# EasyEDA Pro project 包裹款-触摸屏控制板V1.3.eprj, schematic 原理图
Board Name: ESP32s3; Create Date: 2025-05-14; Page Name: 电源; Project Name: 包裹款-触摸屏控制板V1.3; Schematic Name: 原理图; Update Date: 2026-04-14; Company: 嘉立创EDA; Page Size: A3; Version: V1.0
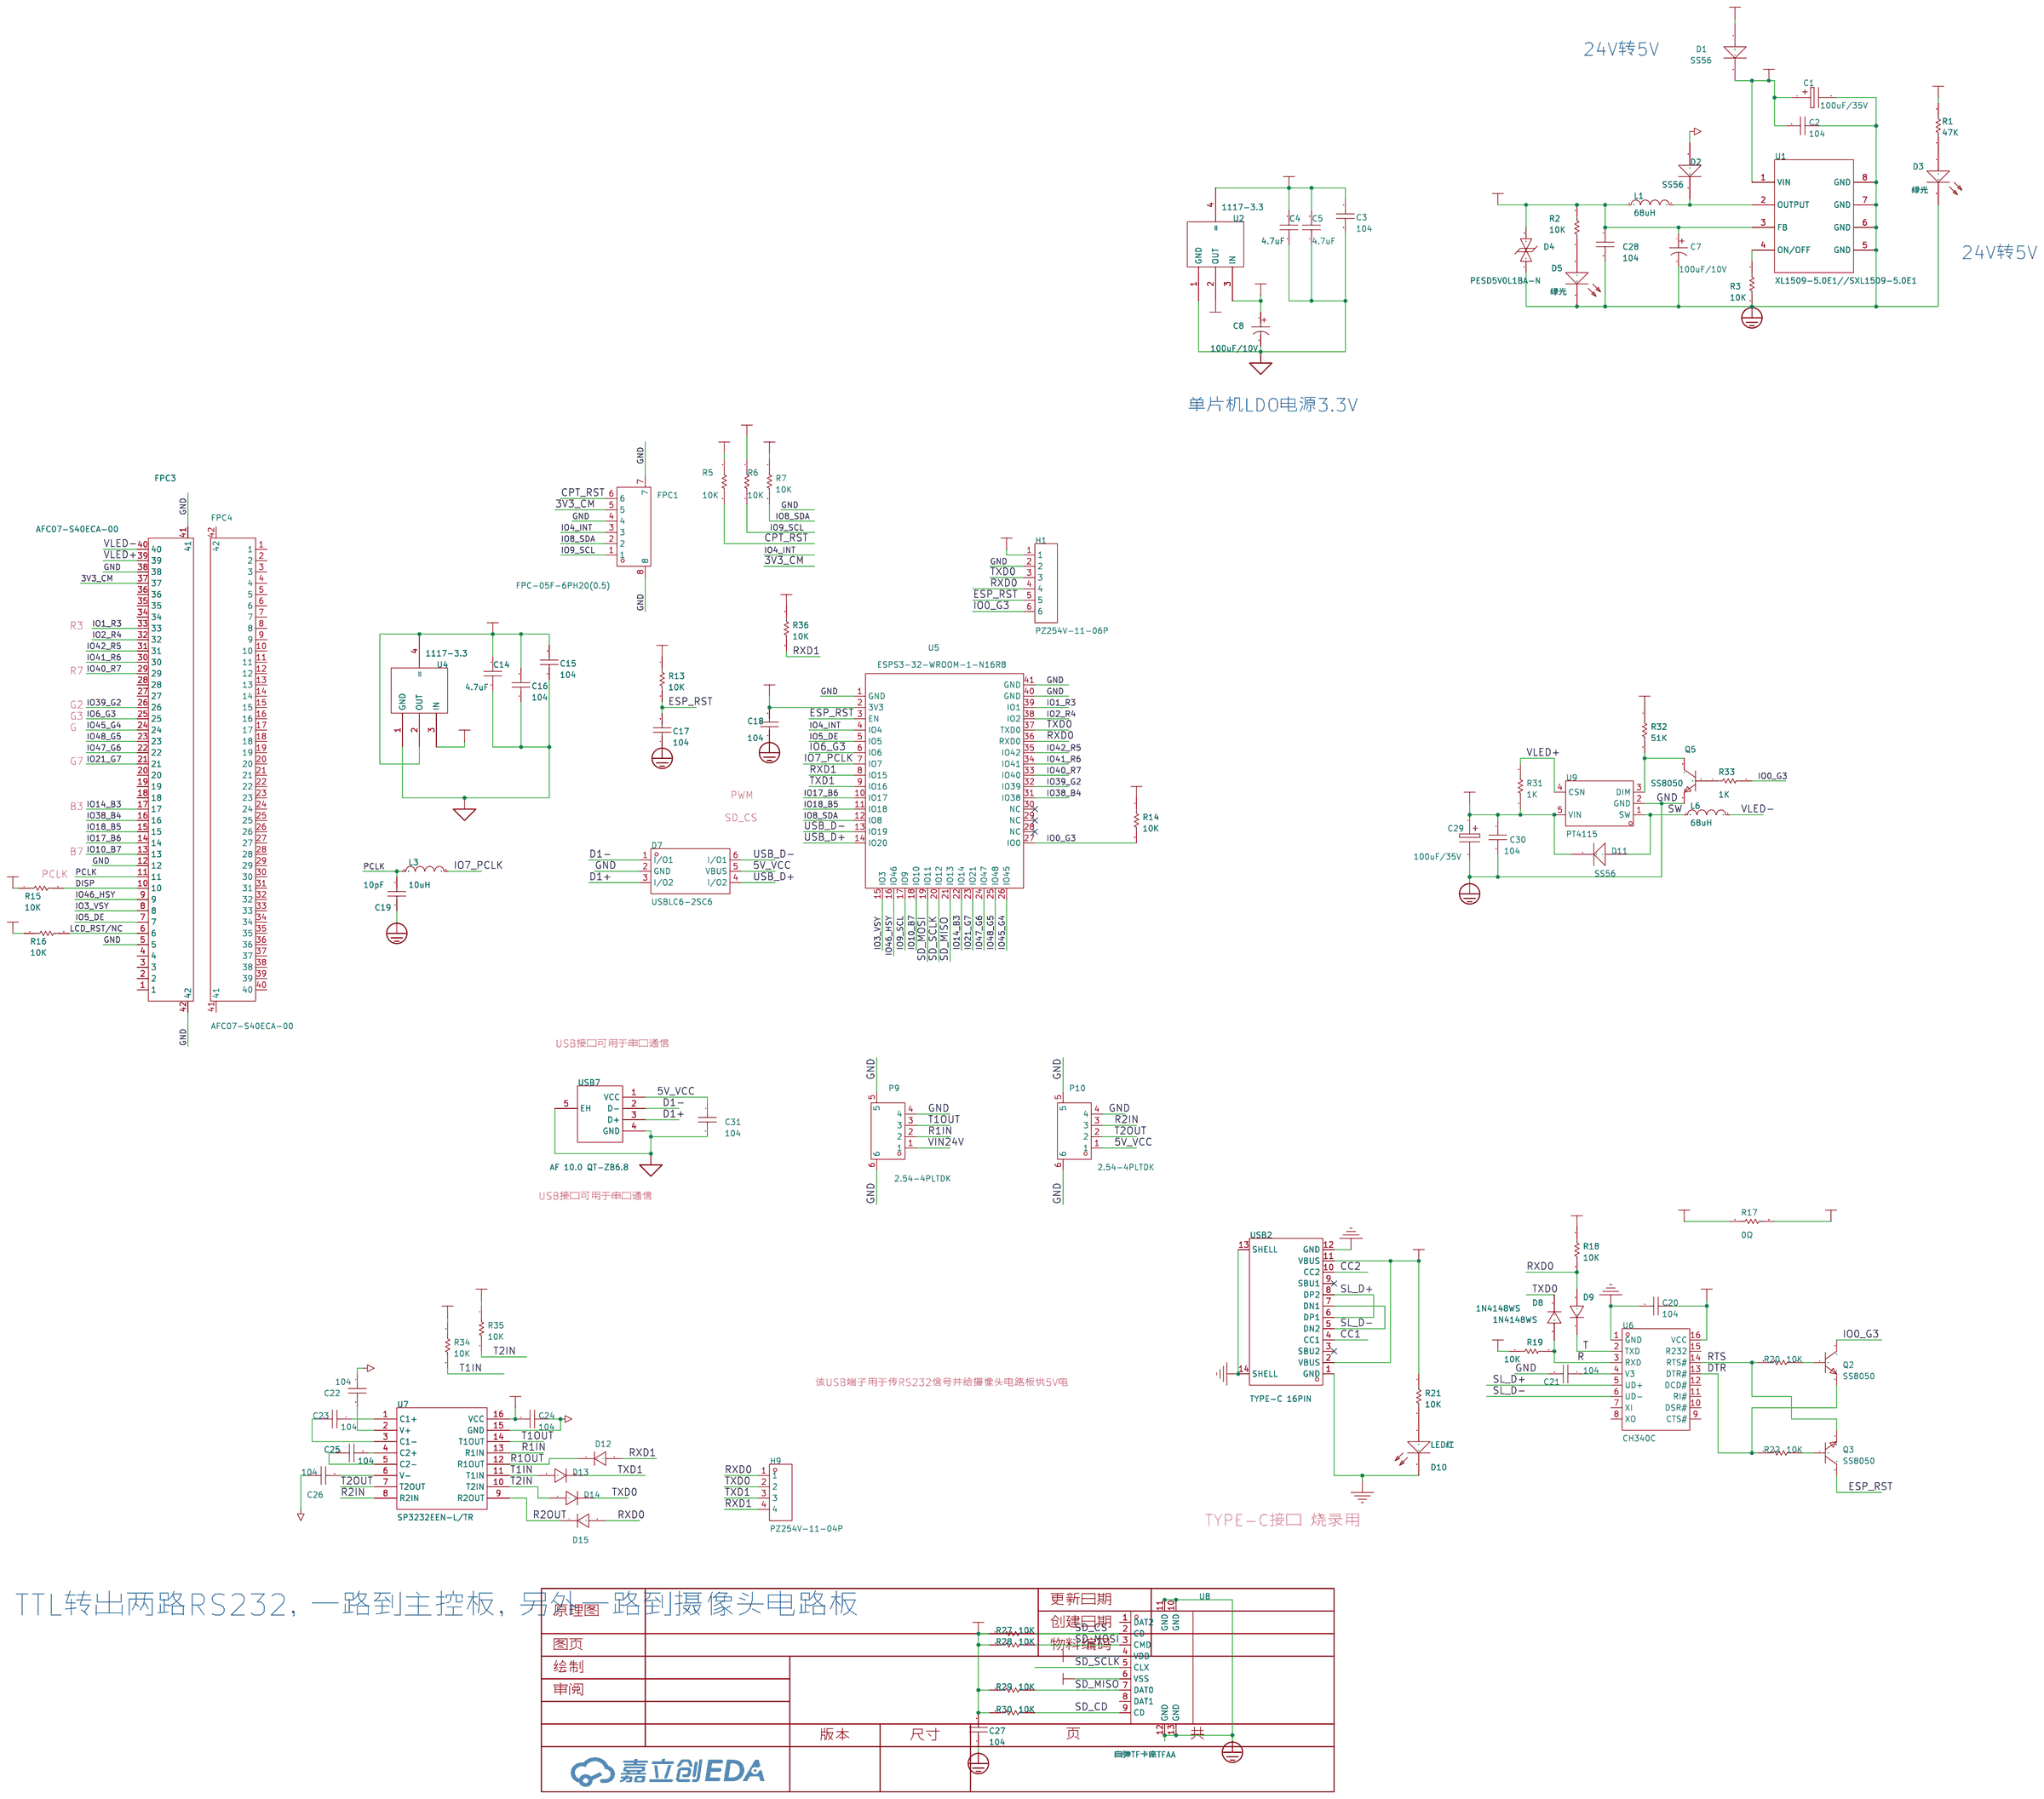
[diagram p0: schematic sheet]

## Parts
C1  100uF/35V  [电解电容贴片6X6]
C2  104  [0603C]
C3  104  [0603C]
C4  4.7uF  [C1206]
C5  4.7uF  [C1206]
C7  100uF/10V  [CAP-SMD_BD5.0-L5.3-W5.3-RD]
C8  100uF/10V  [CAP-SMD_BD5.0-L5.3-W5.3-RD]
C14  4.7uF  [C1206]
C15  104  [0603C]
C16  104  [0603C]
C17  104  [0603C]
C18  104  [0603C]
C19  10pF  [0603C]
C20  104  [0603C]
C21  104  [0603C]
C22  104  [0603C]
C23  104  [0603C]
C24  104  [0603C]
C25  104  [0603C]
C26  104  [0603C]
C27  104  [11]
C28  104  [0603C]
C29  100uF/35V  [电解电容贴片6X6]
C30  104  [0603C]
C31  104  [0603C]
D1  SS56  [SMA]
D2  SS56  [SMA]
D3  绿光  [0603LED]
D4  PESD5V0L1BA-N  [SOD-323_L1.8-W1.3-LS2.5-BI]
D5  绿光  [0603LED]
D7  USBLC6-2SC6  [SOT-23-6_L2.9-W1.6-P0.95-LS2.8-BL]
D8  1N4148WS  [SOD-323_L1.8-W1.3-LS2.5-RD]
D9  1N4148WS  [SOD-323_L1.8-W1.3-LS2.5-RD]
D10  LED红  [0603L]
D11  SS56  [SMA]
D12  1N4148WS  [SOD-323_L1.8-W1.3-LS2.5-RD]
D13  1N4148WS  [SOD-323_L1.8-W1.3-LS2.5-RD]
D14  1N4148WS  [SOD-323_L1.8-W1.3-LS2.5-RD]
D15  1N4148WS  [SOD-323_L1.8-W1.3-LS2.5-RD]
FPC1  FPC-05F-6PH20(0.5)  [FPC-SMD_6P-P0.50_XUNPU_FPC-05F-6PH20]
FPC3  AFC07-S40ECA-00  [FPC-SMD_P0.50-40P_LCS-SJ-H2.0]
FPC4  AFC07-S40ECA-00  [FPC-SMD_P0.50-40P_LCS-SJ-H2.0]
H1  PZ254V-11-06P  [HDR-TH_6P-P2.54-V-M]
H9  PZ254V-11-04P  [HDR-TH_4P-P2.54-V-M]
L1  68uH  [IND-SMD_L7.0-W7.0_SMDRI74-330MT]
L3  10uH  [L0603]
L6  68uH  [IND-SMD_L7.0-W7.0_SMDRI74-330MT]
P9  2.54-4PLTDK  [CONN-SMD_4P-P2.50_SHOU_2.54-4PLTDK]
P10  2.54-4PLTDK  [CONN-SMD_4P-P2.50_SHOU_2.54-4PLTDK]
Q2  SS8050  [SOT-23-3_L2.9-W1.3-P1.90-LS2.4-BR]
Q3  SS8050  [SOT-23-3_L2.9-W1.3-P1.90-LS2.4-BR]
Q5  SS8050  [SOT-23-3_L2.9-W1.3-P1.90-LS2.4-BR]
R1  47K  [0603R]
R2  10K  [0603R]
R3  10K  [0603R]
R5  10K  [0603R]
R6  10K  [0603R]
R7  10K  [0603R]
R13  10K  [0603R]
R14  10K  [0603R]
R15  10K  [0603R]
R16  10K  [0603R]
R17  0Ω  [10]
R18  10K  [0603R]
R19  10K  [0603R]
R20  10K  [10]
R21  10K  [10]
R22  10K  [10]
R27  10K  [10]
R28  10K  [10]
R29  10K  [10]
R30  10K  [10]
R31  1K  [10]
R32  51K  [10]
R33  1K  [10]
R34  10K  [10]
R35  10K  [10]
R36  10K  [0603R]
U1  XL1509-5.0E1//SXL1509-5.0E1  [ESOP-8_L4.9-W3.9-P1.27-LS6.0-BL-EP]
U2  1117-3.3  [SOT-223]
U4  1117-3.3  [SOT-223]
U5  ESPS3-32-WROOM-1-N16R8  [WIRELM-SMD_ESP32-S3-WROOM-2-N32R8V]
U6  CH340C  [SOIC-16_L9.9-W3.9-P1.27-LS6.0-BL]
U7  SP3232EEN-L/TR  [SOIC-16_L9.9-W3.9-P1.27-LS6.0-BL]
U8  自弹TF卡座TFAA  [SIM-SMD_C9900015645]
U9  PT4115  [SOT-89-5_L4.5-W2.5-P1.50-LS4.5-BR]
USB2  TYPE-C 16PIN  [USB-C-SMD_TYPE-C-6PIN+]
USB7  AF 10.0 QT-ZB6.8  [USB-A-SMD_AF-10.0-QT-ZB6.8]

## Library data of the parts
C1 C29 = 100uF/35V: Origin Footprint 2: X47U; Origin Footprint 1: 电解电容贴片6x6; Design Item ID: ELECTRO1; Library Name: *
C2 C3 C15-C19 C28 C30 C31 = 104: Capacitor (Semiconductor SIM Model); Published: 8-Jun-2000; LatestRevisionDate: 17-Jul-2002; LatestRevisionNote: Re-released for DXP Platform.; PackageReference: C1206; Publisher: Altium Limited; Origin Footprint 2: C1206; Origin Footprint 3: 0402; Origin Footprint 4: 1310[0504]; Origin Footprint 5: 1608[0603]; Origin Footprint 6: C1210; Origin Footprint 7: C0805; Origin Footprint 8: C1206; Origin Footprint 9: 0805; Origin Footprint 10: 0805L; Design Item ID: Cap Semi; Library Name: Miscellaneous Devices
C4 C5 C14 = 104: Design Item ID: CAP; Library Name: SCH--װ--
C7 C8 = CS1A101M-CRD54: 容值:100uF;精度:±20%;额定电压:10V;电容体直径:5mm;电容体长度:5.4mm;纹波电流:-;等效串联电阻:-;工作寿命:1000hrs@105℃;工作温度:-40℃~+105℃;; LCSC Part Name: 100uF ±20% 10V; Supplier Part: C96182; Manufacturer: ST(先科); Supplier Footprint: SMD,5x5.4mm; JLCPCB Part Class: Extended Part; Datasheet: https://atta.szlcsc.com/upload/public/pdf/source/20170304/1488621207726.pdf; Supplier: LCSC; Tolerance: ±20%; Rated Voltage: 10V; φD: 5mm; L: 5.4mm; Lifetime @ Temp: 1000hrs@105℃; Operating Temperature: -40℃~+105℃
C20 C22-C26 = 103: Capacitor (Semiconductor SIM Model); Published: 8-Jun-2000; LatestRevisionDate: 17-Jul-2002; LatestRevisionNote: Re-released for DXP Platform.; PackageReference: C1206; Publisher: Altium Limited; Origin Footprint 2: C1206; Origin Footprint 3: 0402; Origin Footprint 4: 1310[0504]; Origin Footprint 5: 1608[0603]; Origin Footprint 6: C1210; Origin Footprint 7: C0805; Origin Footprint 8: C1206; Origin Footprint 9: 0805; Origin Footprint 10: 0805L; Design Item ID: Cap Semi; Library Name: Miscellaneous Devices
C21 = 104: Capacitor (Semiconductor SIM Model); Published: 8-Jun-2000; LatestRevisionDate: 17-Jul-2002; LatestRevisionNote: Re-released for DXP Platform.; PackageReference: C1206; Publisher: Altium Limited; Origin Footprint 2: C1206; Origin Footprint 3: 0402; Origin Footprint 4: 1310[0504]; Origin Footprint 5: 1608[0603]; Origin Footprint 6: C1210; Origin Footprint 7: C0805; Origin Footprint 8: C1206; Origin Footprint 9: 0805; Origin Footprint 10: 0805L; Origin Footprint 11: 0805C; Design Item ID: Cap Semi; Library Name: Miscellaneous Devices
C27 = 104: Capacitor (Semiconductor SIM Model); Published: 8-Jun-2000; LatestRevisionDate: 17-Jul-2002; LatestRevisionNote: Re-released for DXP Platform.; PackageReference: C1206; Publisher: Altium Limited; Origin Footprint 2: C1206; Origin Footprint 3: 0402; Origin Footprint 4: 1310[0504]; Origin Footprint 5: 1608[0603]; Origin Footprint 6: C1210; Origin Footprint 7: C0805; Origin Footprint 8: C1206; Origin Footprint 9: 0805; Origin Footprint 10: 0805L; Origin Footprint 11: 0805C; Origin Footprint 1: 0603C; Design Item ID: Cap Semi; Library Name: Miscellaneous Devices
D1 = SS56: Design Item ID: 1N4148; Library Name: SCH封装库
D2 D11 = SS56: Design Item ID: 1N4148; Library Name: SCH--װ--
D3 D5 = 绿光: Origin Footprint 2: LED(小); Design Item ID: LED; Library Name: SCH封装库
D4 = PESD5V0S1BBN: 极性:Bidirectional;反向关断电压（典型值）:5V (Max);击穿电压（最小值）:6V;箝位电压:15V;峰值脉冲电流（10/1000us）:5A (8/20us);; Supplier Part: C314264; Manufacturer: BORN伯恩半导体; Supplier Footprint: SOD-523; JLCPCB Part Class: Extended Part; Datasheet: https://atta.szlcsc.com/upload/public/pdf/source/20181015/C314264_F9AC5761AC2631DA841FBD1D9C6821E3.pdf; Supplier: LCSC; Polarity: Bidirectional; Voltage - Reverse Standoff (Typ): 5V (Max); Voltage - Breakdown (Min): 6V; Voltage - Clamping (Max) @ Ipp: 15V; Current - Peak Pulse (10/1000μs): 5A (8/20us)
D7 = USBLC6-2SC6: 最大钳位电压:15V;击穿电压:6V;; Supplier Part: C2687116; Manufacturer: UMW(友台半导体); Supplier Footprint: SOT-23-6; JLCPCB Part Class: 扩展库; Datasheet: https://atta.szlcsc.com/upload/public/pdf/source/20231109/512642D850D9873E7C519F71E85B9A10.pdf; Supplier: LCSC; Maximum Clamping Voltage: 15V; Breakdown Voltage: 6V; Number of Lines: 双路; Type: ESD
D8 D9 D12-D15 = 1N4148WS_C2128: 二极管配置:独立式;正向压降(Vf):1.25V@150mA;直流反向耐压(Vr):100V;整流电流:150mA;反向恢复时间(Trr):4ns;; LCSC Part Name: 丝印T4 1N4148WS; Supplier Part: C2128; Manufacturer: CJ(江苏长电/长晶); Supplier Footprint: SOD-323; JLCPCB Part Class: 基础库; Datasheet: https://item.szlcsc.com/datasheet/1N4148WS/2485.html; Supplier: LCSC; Diode Configuration: 独立式; Voltage - Forward(Vf@If): 1.25V@150mA; Voltage - DC Reverse(Vr): 100V; Current - Rectified: 150mA; Pd - Power Dissipation: 200mW; Reverse Leakage Current (Ir): 1uA@75V; Reverse Recovery Time (trr): 4ns; Non-Repetitive Peak Forward Surge Current: 2A
D10 = LED3: Typical BLUE SiC LED; Published: 8-Jun-2000; LatestRevisionDate: 17-Dec-2003; LatestRevisionNote: PCB Footprint replaced.; DatasheetVersion: 16-Apr-2002; PackageVersion: 16-Apr-2002; PackageReference: 3.5X2.8X1.9; Publisher: Altium Limited; PackageDescription: SM LED; 2 C-Bend Leads; Body 3.5 x 2.8 x 1.9 mm, inc leads (LxWxH typ); Origin Footprint 2: 3.5X2.8X1.9; Library Name: Miscellaneous Devices; Check: true
FPC1 = FPC-05F-6PH20: LCSC Part Name: 翻盖式 卧贴 P数:6P 间距:0.5mm; Supplier Part: C2856796; Manufacturer: XUNPU(讯普); Supplier Footprint: SMD,P=0.5mm,卧贴; JLCPCB Part Class: 扩展库; Datasheet: https://item.szlcsc.com/datasheet/FPC-05F-6PH20/3056894.html; Supplier: LCSC; Locking Feature: 翻盖式; Contact Type: 卧贴; Number of Contacts: 6P; Pitch: 0.5mm; Mounting Type: 下接; FFC, FCB Thickness: 0.3mm; Height Above Board: 2mm; Contact Material: 磷青铜; Contact Plating: 锡; Operating Temperature: -25℃~+85℃; Rated Voltage (Max): 50V; Current Rating (Max): 500mA
FPC3 FPC4 = AFC07-S40ECA-00: LCSC Part Name: 间距:0.5mm P数:40P 抽屉式 上接; Supplier Part: C262648; Manufacturer: JS(钜硕电子); Supplier Footprint: SMD,P=0.5mm,卧贴; JLCPCB Part Class: 扩展库; Datasheet: https://item.szlcsc.com/datasheet/AFC07-S40ECA-00/253907.html; Supplier: LCSC; Locking Feature: 抽屉式; Contact Type: 上接; Number of Contacts: 40P; Pitch: 0.5mm; Mounting Type: 卧贴; FFC, FCB Thickness: 0.3mm; Height Above Board: 2mm
H1 = PZ254V-11-06P: 插针结构:1x6P;间距:2.54mm;行距:-;圆针/方针:方针;安装方式:直插;排数:单排;总PIN位数:6P;额定电流:-;额定电压:-;配合针长度:6mm;塑高:2.5mm;端接针长度:3mm;触头材质:黄铜;触头镀层:-;工作温度:-40℃~+105℃;颜色:黑色;; LCSC Part Name: 1x6P 间距:2.54mm 方针 直插; Supplier Part: C492405; Manufacturer: XFCN(兴飞); Supplier Footprint: 插件,P=2.54mm; JLCPCB Part Class: 扩展库; Datasheet: https://item.szlcsc.com/datasheet/PZ254V-11-06P/502961.html; Supplier: LCSC; Pin Structure: 1x6P; Pitch: 2.54mm; Circluar Pins/Square Pins: 方针; Mounting Type: 直插; Number of Rows: 单排; Number of Pins: 6P; Length of Mating Pin: 6mm; Insulation Height: 2.5mm; Length of End Connection Pin: 3mm; Contact Material: 黄铜; Operating Temperature: -40℃~+105℃; Color: 黑色
H9 = PZ254V-11-04P: LCSC Part Name: 1x4P 间距:2.54mm 方针 直插; Supplier Part: C2691448; Manufacturer: XFCN(兴飞); Supplier Footprint: 插件,P=2.54mm; JLCPCB Part Class: 扩展库; Datasheet: https://item.szlcsc.com/datasheet/PZ254V-11-04P/2801085.html; Supplier: LCSC; Pin Structure: 1x4P; Pitch: 2.54mm; Circluar Pins/Square Pins: 方针; Mounting Type: 直插; Number of Rows: 单排; Number of Pins: 4P; Current Rating: 3A; Voltage Rating (Max): 250V; Length of Mating Pin: 6mm; Insulation Height: 2.5mm; Length of End Connection Pin: 3mm; Operating Temperature: -40℃~+105℃; Color: 黑色
L1 L6 = SMDRI74-330MT: 电感值:33uH;精度:±20%;额定电流:960mA;饱和电流(Isat):1.8A;类型:屏蔽电感;; LCSC Part Name: 33uH±20%1.8A; Supplier Part: C49625; Manufacturer: SXN(顺翔诺); Supplier Footprint: SMD,7.5x7.5mm; JLCPCB Part Class: 扩展库; Datasheet: https://atta.szlcsc.com/upload/public/pdf/source/20210810/6F96FDC19AA308DD2AD166FFB9640E87.pdf; Supplier: LCSC; Tolerance: ±20%; Rated Current: 960mA; Saturation Current (Isat): 1.8A; DC Resistance (DCR): 170mΩ; Type: 屏蔽电感
L3 = SDFL1608S100KTF: LCSC Part Name: 10uH ±10%; Supplier Part: C1035; Manufacturer: Sunlord(顺络); Supplier Footprint: 0603; JLCPCB Part Class: 基础库; Datasheet: https://item.szlcsc.com/datasheet/SDFL1608S100KTF/1387.html; Supplier: LCSC; Tolerance: ±10%; Current Rating: 3mA; DC Resistance(DCR): 1.85Ω; Q @ Frequency: 30@2MHz; Frequency - Self Resonant: 17MHz
P9 P10 = 2.54-4PLTDK: 插针结构:1x4P;间距:2.5mm;安装方式:立贴;参考系列:XHB;总PIN数:4P;排数:1;每排PIN数:4;额定电流:3A;触头材质:黄铜;触头镀层:锡;工作温度:-25℃~+85℃;; LCSC Part Name: 2.54-4P立贴加盖带扣编带; Supplier Part: C3008569; Manufacturer: SHOU HAN(首韩); Supplier Footprint: SMD,P=2.5mm; JLCPCB Part Class: 扩展库; Datasheet: https://item.szlcsc.com/datasheet/2.54-4PLTDK/3501416.html; Supplier: LCSC; Pins Structure: 1x4P; Pitch: 2.5mm; Mounting Type: 立贴; Reference Series: XHB; Number of Pins: 4P; Number of Rows: 1; Number of PINs Per Row: 4; Current Rating: 3A; Contact Material: 黄铜; Contact Plating: 锡; Operating Temperature: -25℃~+85℃; Voltage Rating: 250V; Plastic Material: LCP; Flame Retardant Rating: UL94V-0; Color: 米色
Q2 Q3 Q5 = SS8050: LCSC Part Name: NPN 25V 1.5A 120-400 SOT-23; Supplier Part: C2931717; Manufacturer: Doeshare(德芯); Supplier Footprint: SOT-23; JLCPCB Part Class: 扩展库; Datasheet: https://atta.szlcsc.com/upload/public/pdf/source/20220106/99F9A3DFCBDD91265C711555CE6390BF.pdf; Supplier: LCSC
R1 = 1K: Resistor; Published: 8-Jun-2000; LatestRevisionDate: 17-Jul-2002; LatestRevisionNote: Re-released for DXP Platform.; PackageReference: AXIAL-0.3; Publisher: Altium Limited; Origin Footprint 2: AXIAL-0.3; Origin Footprint 3: R0805; Origin Footprint 4: 0805R; Design Item ID: RES; Library Name: SCH封装库
R2 R5-R7 R13-R16 R18 R19 R36 = 10K: Resistor; Published: 8-Jun-2000; LatestRevisionDate: 17-Jul-2002; LatestRevisionNote: Re-released for DXP Platform.; PackageReference: AXIAL-0.3; Publisher: Altium Limited; Origin Footprint 2: AXIAL-0.3; Origin Footprint 3: R0805; Origin Footprint 4: 0805R; Design Item ID: RES; Library Name: SCH封装库
R3 = 10k: Resistor; Published: 8-Jun-2000; LatestRevisionDate: 17-Jul-2002; LatestRevisionNote: Re-released for DXP Platform.; PackageReference: AXIAL-0.3; Publisher: Altium Limited; Origin Footprint 2: AXIAL-0.3; Origin Footprint 3: R0805; Origin Footprint 4: 0805R; Design Item ID: RES; Library Name: SCH封装库
R17 R20-R22 R27-R35 = 10K: Resistor; Published: 8-Jun-2000; LatestRevisionDate: 17-Jul-2002; LatestRevisionNote: Re-released for DXP Platform.; PackageReference: AXIAL-0.3; Publisher: Altium Limited; Origin Footprint 2: AXIAL-0.3; Origin Footprint 3: R0805; Origin Footprint 4: 0805R; Origin Footprint 1: 0603R; Design Item ID: RES; Library Name: SCH封装库
U1 = XL1509-5.0E1: 功能类型:降压型;同步整流:-;输出通道数:-;拓扑结构:-;输入电压:-;输出电流(最大值):-;开关频率:-;; LCSC Part Name: 降压型; Supplier Part: C61063; Manufacturer: XLSEMI(芯龙); Supplier Footprint: SOP-8_150mil; JLCPCB Part Class: Basic Part; Datasheet: https://atta.szlcsc.com/upload/public/pdf/source/20151020/1457707483545.pdf; Supplier: LCSC; Function: 降压型
U2 U4 = 1117-3.3: Design Item ID: LM1117; Library Name: Party600
U5 = ESP32-S3-WROOM-2-N32R8V: Supplier Part: C3021270; Manufacturer: ESPRESSIF(乐鑫); Supplier Footprint: SMD-41P; JLCPCB Part Class: 扩展库; Datasheet: https://atta.szlcsc.com/upload/public/pdf/source/20240130/C1D348304CAAF72A05B43D2BF874139A.pdf; Supplier: LCSC; Core Processor: ESP32-S3R8V芯片; Support Interface: I2C；GPIO；SPI；PWM；ADC；UART；USB；I2S; Output Power: 20.5dBm
U6 = CH340G: 应用功能:收发器;接口协议:USB 2.0;数据速率:2Mbps;; LCSC Part Name: USB转串口芯片 CH340; Supplier Part: C14267; Manufacturer: WCH(南京沁恒); Supplier Footprint: SOP-16; JLCPCB Part Class: 扩展库; Datasheet: https://atta.szlcsc.com/upload/public/pdf/source/20230530/6E401E9554E9F5311886CC8B3F89B62E.pdf; Supplier: LCSC; Applications Function: 收发器; Protocol: USB 2.0; Supply Voltage: 3.3V；5V; Data Rate: 2Mbps
U7 = SP3232EEN-L/TR: LCSC Part Name: True3.0V至5.5V RS-232收发器; Supplier Part: C9378; Manufacturer: MaxLinear(迈凌); Supplier Footprint: SOIC-16; JLCPCB Part Class: 扩展库; Datasheet: https://item.szlcsc.com/datasheet/SP3232EEN-L%252FTR/9907.html; Supplier: LCSC; Type: 收发器; Number of Drivers: 2; Number of Receivers: 2; Data Rate: 235Kbps; Voltage - Supply: 3V~5.5V; Operating Temperature: -40℃~+85℃
U8 = 自弹TF卡座TFAA: Supplier Part: C9900015645; Supplier Footprint: SMD; JLCPCB Part Class: 扩展库; Supplier: LCSC
U9 = PT4115_C347356: LCSC Part Name: 30 V/1.2 A高调光比LED恒流驱动器; Supplier Part: C347356; Manufacturer: UMW(友台半导体); Supplier Footprint: SOT-89-5; JLCPCB Part Class: 扩展库; Datasheet: https://item.szlcsc.com/datasheet/PT4115/324016.html; Supplier: LCSC; Type: DC-DC; Voltage - Input(DC): 6V~30V; Frequency - Switching: 1MHz; Output Current: 1.2A; Dimming: PWM；模拟; Features: 过温保护(OTP); Topology: 降压; Operating temperature: -25℃~+85℃; Switch Tube (Built-In/External): 内置; Constant Current Accuracy: 5%
USB2 = TYPE-C 16PIN 2MD(073): 连接器类型:Type-C;标准:-;公母:母;端口数量:1;触点数量:16P;安装方式:卧贴;额定电流 - 电源:5A;工作温度范围:-25℃~+85℃;; LCSC Part Name: Type-C 母 卧贴; Supplier Part: C2765186; Manufacturer: SHOU HAN(首韩); Supplier Footprint: SMD; JLCPCB Part Class: Extended Part; Datasheet: https://atta.szlcsc.com/upload/public/pdf/source/20211123/39B17C16241EAC15C5E277BDA434118E.pdf; Supplier: LCSC; Connector Type: Type-C; Gender: 母; Number of Ports: 1; Number of Contacts: 16P; Mounting Style: 卧贴; Current Rating - Power (Max): 5A; Operating Temperature Range: -25℃~+85℃
USB7 = AF 10.0 QT-ZB6.8: 连接器类型:Type-A;协议标准:USB 2.0;公母:母;安装方式:卧贴;触点数量:4P;端口数量:1;额定电流 - 电源:1.5A;工作温度:-25℃~+85℃;; LCSC Part Name: Type-A 母 卧贴; Supplier Part: C456016; Manufacturer: SHOU HAN(首韩); Supplier Footprint: SMD; Datasheet: https://item.szlcsc.com/datasheet/AF%252010.0%2520QT-ZB6.8/458823.html; Supplier: LCSC; Connector Type: Type-A; Protocol Standard: USB 2.0; Gender: 母; Mounting Type: 卧贴; Number of Contacts: 4P; Number of Ports: 1; Current Rating-Power: 1.5A; Voltage Rating: 30V; Connect-Disconnect Life: 5千次; Length: 10mm; Detection color: 黑色; Operating Temperature: -25℃~+85℃

## Nets
3V3: C3.2 C4.2 C5.2 C18.2 C27.2 R13.1 R14.1 R18.2 R27.2 R28.2 R29.2 R30.2 R36.1 U2.2(OUT) U2.4(=) U5.2(3V3) U8.4(VDD)
3V3_CM: C14.2 C15.2 C16.2 FPC1.5 FPC3.37 R5.1 R6.1 R7.1 R15.1 R16.1 U4.2(OUT) U4.4(=)
5V_SHAOLU: R17.1 R21.1 USB2.2(VBUS) USB2.11(VBUS)
5V_VCC: C7.1 C8.1 C20.1 C24.2 C28.1 C31.1 D4.2 D7.5(VBUS) H1.1 L1.1 P10.1 R2.2 R17.2 R19.1 R34.1 R35.1 U1.3(FB) U2.3(IN) U4.3(IN) U6.16(VCC) U7.16(VCC) USB7.1(VCC)
24V_D1: C1.1 C2.2 C29.1 C30.1 D1.2 D11.2 R1.2 R31.1 R32.1 U1.1(VIN) U9.5(VIN)
GND: C1.2 C2.1 C3.1 C4.1 C5.1 C7.2 C8.2 C14.1 C15.1 C16.1 C17.1 C18.1 C19.1 C20.2 C21.2 C22.1 C24.1 C26.2 C27.1 C28.2 C29.2 C30.2 C31.2 D2.1 D3.2 D4.1 D5.2 D7.2(GND) D10.2(K) FPC1.4 FPC1.7 FPC1.8 FPC3.5 FPC3.12 FPC3.38 FPC3.41 FPC3.42 H1.2 P9.4 P9.5 P9.6 P10.4 P10.5 P10.6 Q5.2(E) R3.2 U1.5(GND) U1.6(GND) U1.7(GND) U1.8(GND) U2.1(GND) U4.1(GND) U5.1(GND) U5.40(GND) U5.41(GND) U6.1(GND) U7.15(GND) U8.6(VSS) U8.10(GND) U8.11(GND) U8.12(GND) U8.13(GND) U9.2(GND) USB2.1(GND) USB2.12(GND) USB2.13(SHELL) USB2.14(SHELL) USB7.4(GND) USB7.5(EH)
VIN24V: D1.1 P9.1
CC1: USB2.4(CC1)
CC2: USB2.10(CC2)
CPT_RST: FPC1.6 R5.2
D1+: D7.3(I/O2) USB7.3(D+)
D1-: D7.1(I/O1) USB7.2(D-)
DISP: FPC3.10 R15.2
DTR: Q2.2(E) R22.2 U6.13(DTR#)
ESP_RST: C17.2 H1.5 Q3.3(C) R13.2 U5.3(EN)
IO0_G3: H1.6 Q2.3(C) R14.2 R33.2 U5.27(IO0)
IO1_R3: FPC3.33 U5.39(IO1)
IO2_R4: FPC3.32 U5.38(IO2)
IO3_VSY: FPC3.8 U5.15(IO3)
IO4_INT: FPC1.3 U5.4(IO4)
IO5_DE: FPC3.7 U5.5(IO5)
IO6_G3: FPC3.25 U5.6(IO6)
IO7_PCLK: L3.2 U5.7(IO7)
IO8_SDA: FPC1.2 R7.2 U5.12(IO8)
IO9_SCL: FPC1.1 R6.2 U5.17(IO9)
IO10_B7: FPC3.13 U5.18(IO10)
IO14_B3: FPC3.17 U5.22(IO14)
IO17_B6: FPC3.14 U5.10(IO17)
IO18_B5: FPC3.15 U5.11(IO18)
IO21_G7: FPC3.21 U5.23(IO21)
IO38_B4: FPC3.16 U5.31(IO38)
IO39_G2: FPC3.26 U5.32(IO39)
IO40_R7: FPC3.29 U5.33(IO40)
IO41_R6: FPC3.30 U5.34(IO41)
IO42_R5: FPC3.31 U5.35(IO42)
IO45_G4: FPC3.24 U5.26(IO45)
IO46_HSY: FPC3.9 U5.16(IO46)
IO47_G6: FPC3.22 U5.24(IO47)
IO48_G5: FPC3.23 U5.25(IO48)
LCD_RST/NC: FPC3.6 R16.2
PCLK: C19.2 FPC3.11 L3.1
R: D8.2(A) R19.2 U6.3(RXD)
R1IN: P9.2 U7.13(R1IN)
R1OUT: D12.1(K) U7.12(R1OUT)
R2IN: P10.3 U7.8(R2IN)
R2OUT: D15.1(K) U7.9(R2OUT)
RTS: Q3.2(E) R20.2 U6.14(RTS#)
RXD0: D9.2(A) D15.2(A) H1.4 H9.1 R18.1 U5.36(RXD0)
RXD1: D12.2(A) H9.4 R36.2 U5.8(IO15)
SD_CD: R30.1 U8.9(CD)
SD_CS: R27.1 U8.2(CD)
SD_MISO: R29.1 U5.21(IO13) U8.7(DAT0)
SD_MOSI: R28.1 U5.19(IO11) U8.3(CMD)
SD_SCLK: U5.20(IO12) U8.5(CLX)
SL_D+: U6.5(UD+) USB2.6(DP1) USB2.8(DP2)
SL_D-: U6.6(UD-) USB2.5(DN2) USB2.7(DN1)
SW: D11.1 L6.1 U9.1(SW)
T: D9.1(K) U6.2(TXD)
T1IN: D13.2(A) R34.2 U7.11(T1IN)
T1OUT: P9.3 U7.14(T1OUT)
T2IN: D14.2(A) R35.2 U7.10(T2IN)
T2OUT: P10.2 U7.7(T2OUT)
TXD0: D8.1(K) D14.1(K) H1.3 H9.2 U5.37(TXD0)
TXD1: D13.1(K) H9.3 U5.9(IO16)
USB_D+: D7.4(I/O2) U5.14(IO20)
USB_D-: D7.6(I/O1) U5.13(IO19)
VLED+: FPC3.39 R31.2 U9.4(CSN)
VLED-: FPC3.40 L6.2
$9N274640: D2.2 L1.2 U1.2(OUTPUT)
$9N274642: R3.1 U1.4(ON/OFF)
$9N274647: D3.1 R1.1
$9N274649: D5.1 R2.1
$9N275850: C21.1 U6.4(V3)
$9N275879: Q2.1(B) R20.1
$9N275880: Q3.1(B) R22.1
$9N276006: D10.1(A) R21.2
$9N276822: C26.1 U7.6(V-)
$9N276825: C22.2 U7.2(V+)
$9N276826: C25.2 U7.4(C2+)
$9N276827: C25.1 U7.5(C2-)
$9N276828: C23.2 U7.1(C1+)
$9N276829: C23.1 U7.3(C1-)
$9N298193: Q5.3(C) R32.2 U9.3(DIM)
$9N298310: Q5.1(B) R33.1

Not connected (* = marked no-connect by the designer): FPC3 1 2 3 4 18 19 20 27 28 34 35 36; FPC4 1 2 3 4 5 6 7 8 9 10 11 12 13 14 15 16 17 18 19 20 21 22 23 24 25 26 27 28 29 30 31 32 33 34 35 36 37 38 39 40 41 42; U5 28(NC)* 29(NC)* 30(NC)*; U6 7(XI) 8(XO) 9(CTS#) 10(DSR#) 11(RI#) 12(DCD#) 15(R232); U8 1(DAT2) 8(DAT1); USB2 3(SBU2)* 9(SBU1)*

## Notes on the sheet
- 24V转5V
- 24V转5V
- 单片机LDO电源3.3V
- R3
- R7
- G2
- G3
- G
- G7
- PWM
- B3
- SD_CS
- B7
- PCLK
- USB接口可用于串口通信
- USB接口可用于串口通信
- 该USB端子用于传RS232信号并给摄像头电路板供5V电
- TYPE-C接口 烧录用
- TTL转出两路RS232，一路到主控板，另外一路到摄像头电路板
